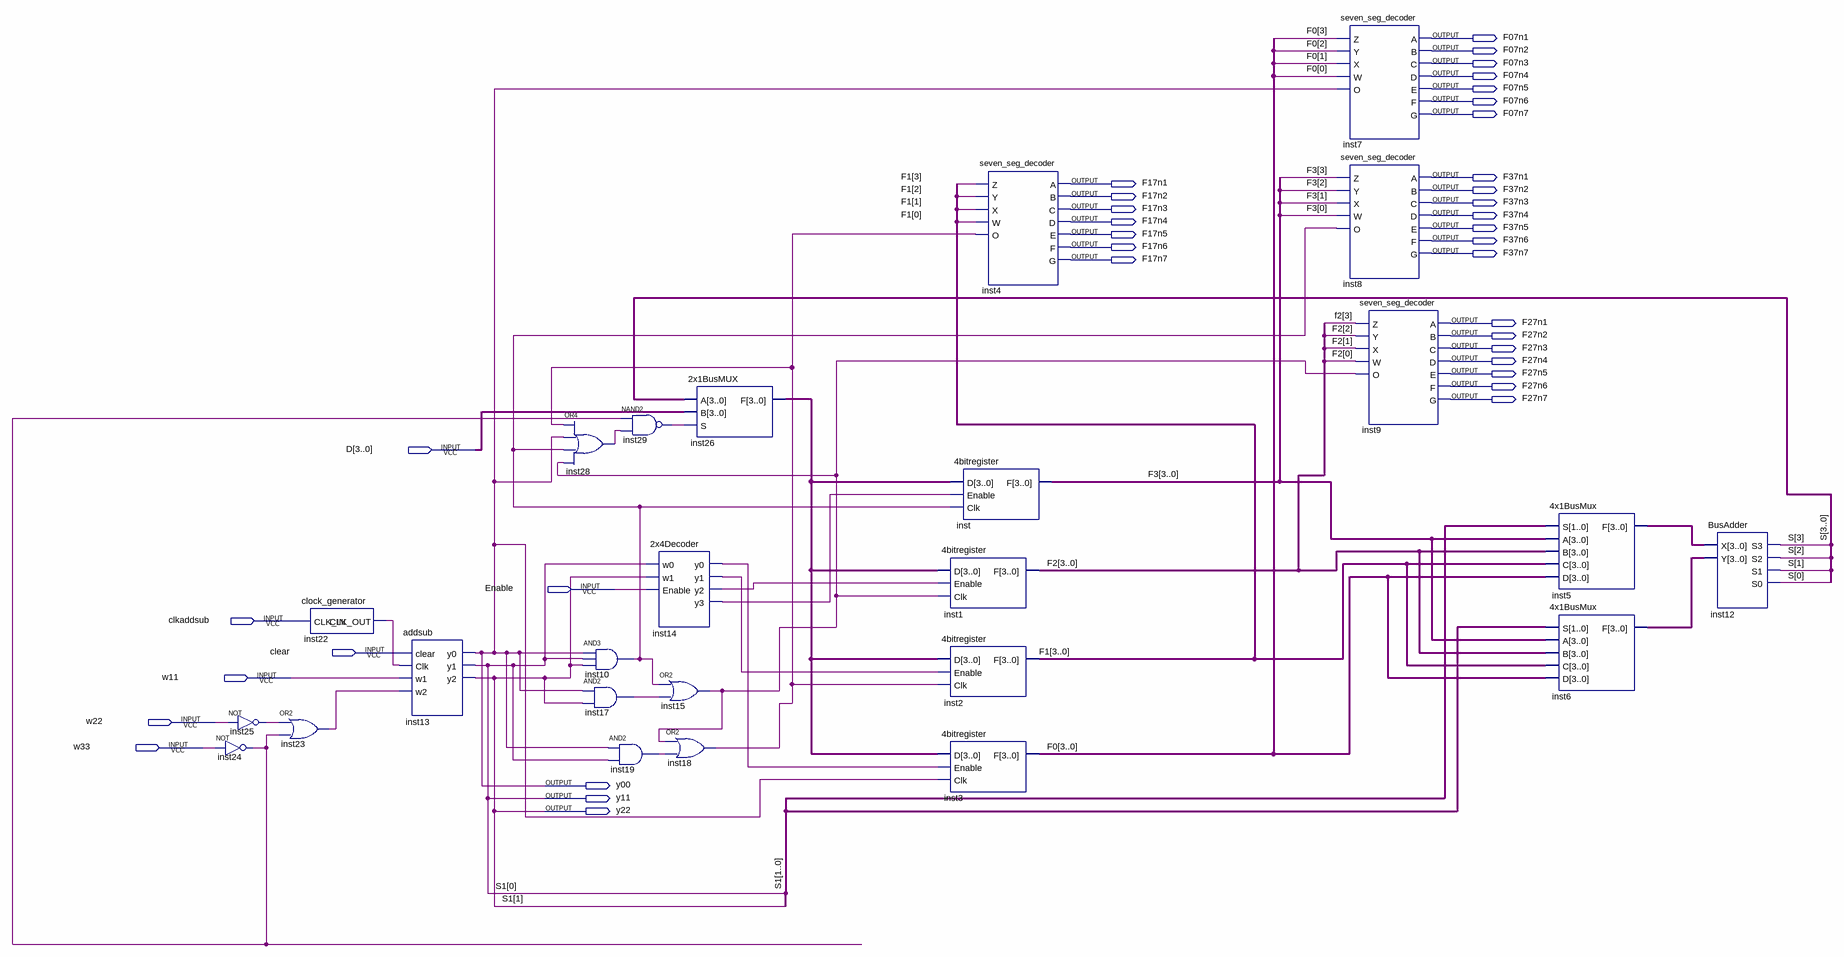
[diagram p0: schematic sheet]
// Quartus schematic project.bdf as structural Verilog: 25 symbols, 38 pins
module project (
  input  [3:0] D,
  input  Enable,
  input  clkaddsub,
  input  clear,
  input  w11,
  input  w22,
  input  w33,
  output F07n1,
  output F07n2,
  output F07n3,
  output F07n4,
  output F07n5,
  output F07n6,
  output F07n7,
  output F37n1,
  output F17n1,
  output F37n2,
  output F17n2,
  output F37n3,
  output F17n3,
  output F37n4,
  output F17n4,
  output F37n5,
  output F17n5,
  output F37n6,
  output F17n6,
  output F37n7,
  output F17n7,
  output F27n1,
  output F27n2,
  output F27n3,
  output F27n4,
  output F27n5,
  output F27n6,
  output F27n7,
  output y00,
  output y11,
  output y22
);

  wire inst10_out, inst14_y0, inst14_y1, inst14_y2, inst14_y3, inst15_out, inst17_out, inst18_out,
       inst19_out, inst22_clk_out, inst23_out, inst24_out, inst25_out, inst28_out, inst29_out;
  wire [3:0] F0, F1, F2, F3, inst5_f, inst6_f, inst26_f, S;

  not inst25 (inst25_out, w22);
  not inst24 (inst24_out, w33);
  or inst23 (inst23_out, inst25_out, inst24_out);
  clock_generator inst22 (.CLK_IN(clkaddsub), .CLK_OUT(inst22_clk_out));
  addsub inst13 (.clear(clear), .Clk(inst22_clk_out), .w1(w11), .w2(inst23_out), .y0(y00), .y1(y11), .y2(y22));
  or inst28 (inst28_out, inst18_out, y00, inst10_out, inst15_out);
  and inst10 (inst10_out, y00, y11, y22);
  and inst17 (inst17_out, y00, y22);
  nand inst29 (inst29_out, inst24_out, inst28_out);
  and inst19 (inst19_out, y00, y11);
  \2x1BusMUX  inst26 (.A(S), .B(D), .S(inst29_out), .F(inst26_f));
  \2x4Decoder  inst14 (
    .w0(y11), .w1(y22), .Enable(Enable), .y0(inst14_y0), .y1(inst14_y1), .y2(inst14_y2), .y3(inst14_y3));
  or inst15 (inst15_out, inst10_out, inst17_out);
  or inst18 (inst18_out, inst15_out, inst19_out);
  \4bitregister  inst1 (.D(inst26_f), .Enable(inst14_y2), .Clk(inst15_out), .F(F2));
  \4bitregister  inst2 (.D(inst26_f), .Enable(inst14_y1), .Clk(inst18_out), .F(F1));
  \4bitregister  inst3 (.D(inst26_f), .Enable(inst14_y0), .Clk(y00), .F(F0));
  seven_seg_decoder inst4 (
    .Z(F1[3]), .Y(F1[2]), .X(F1[1]), .W(F1[0]), .O(inst18_out), .A(F17n1), .B(F17n2), .C(F17n3), .D(F17n4),
    .E(F17n5), .F(F17n6), .G(F17n7));
  \4bitregister  inst (.D(inst26_f), .Enable(inst14_y3), .Clk(inst10_out), .F(F3));
  seven_seg_decoder inst7 (
    .Z(F0[3]), .Y(F0[2]), .X(F0[1]), .W(F0[0]), .O(y00), .A(F07n1), .B(F07n2), .C(F07n3), .D(F07n4),
    .E(F07n5), .F(F07n6), .G(F07n7));
  seven_seg_decoder inst8 (
    .Z(F3[3]), .Y(F3[2]), .X(F3[1]), .W(F3[0]), .O(inst10_out), .A(F37n1), .B(F37n2), .C(F37n3), .D(F37n4),
    .E(F37n5), .F(F37n6), .G(F37n7));
  seven_seg_decoder inst9 (
    .Z(F2[3]), .Y(F2[2]), .X(F2[1]), .W(F2[0]), .O(inst15_out), .A(F27n1), .B(F27n2), .C(F27n3), .D(F27n4),
    .E(F27n5), .F(F27n6), .G(F27n7));
  \4x1BusMux  inst5 (.S({y22, y11}), .A(F3), .B(F2), .C(F1), .D(F0), .F(inst5_f));
  \4x1BusMux  inst6 (.S({y22, y11}), .A(F3), .B(F2), .C(F1), .D(F0), .F(inst6_f));
  BusAdder inst12 (.X(inst5_f), .Y(inst6_f), .S3(S[3]), .S2(S[2]), .S1(S[1]), .S0(S[0]));

  // Other names for the same wires on the sheet: S1[1:0] = {y22, y11}
endmodule
